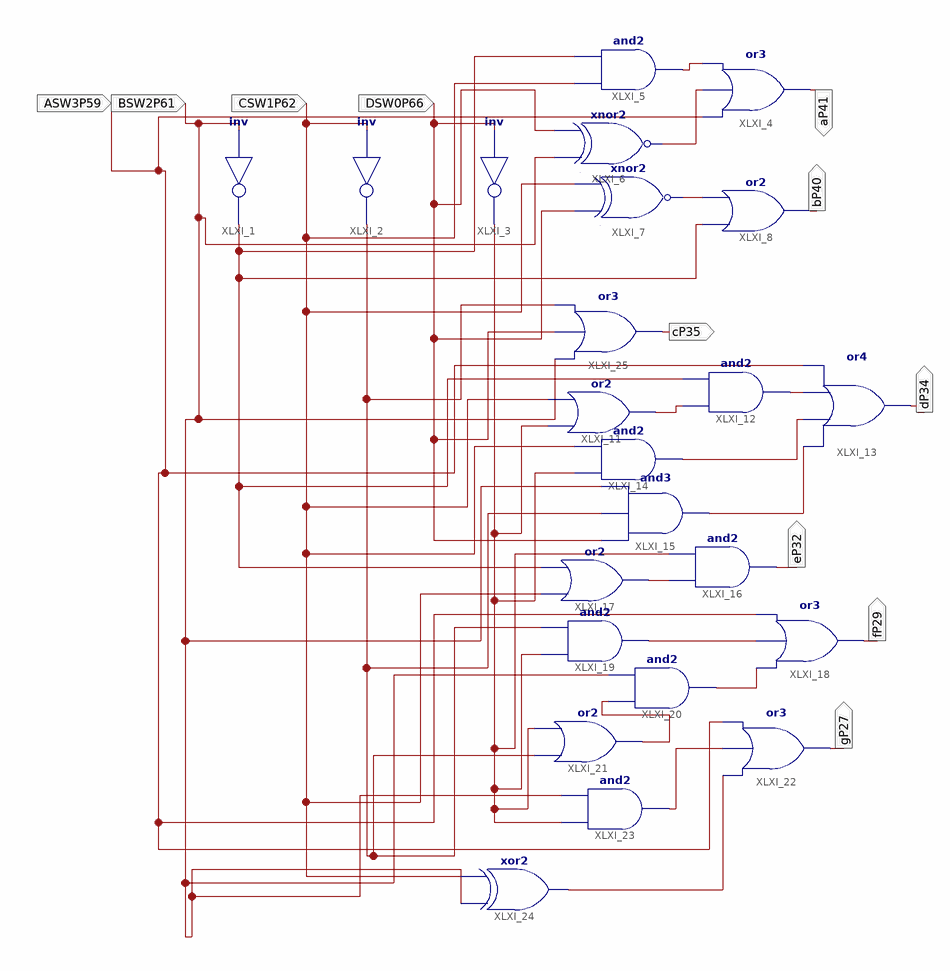
[diagram p0: schematic sheet 1]
// Xilinx ISE schematic lab5sch.sch (spartan6) as structural Verilog: 23 symbols, 11 ports
module lab5sch (
  input  ASW3P59,
  input  CSW1P62,
  input  DSW0P66,
  input  BSW2P61,
  output aP41,
  output bP40,
  output cP35,
  output dP34,
  output eP32,
  output fP29,
  output gP27
);

  wire XLXN_14, XLXN_17, XLXN_22, XLXN_23, XLXN_25, XLXN_27, XLXN_32, XLXN_34, XLXN_35, XLXN_37, XLXN_42,
       XLXN_45, XLXN_46, XLXN_49, XLXN_52, XLXN_55;

  not XLXI_1 (XLXN_14, BSW2P61);
  not XLXI_2 (XLXN_27, CSW1P62);
  not XLXI_3 (XLXN_17, DSW0P66);
  and XLXI_5 (XLXN_22, CSW1P62, XLXN_14);
  or XLXI_4 (aP41, ASW3P59, XLXN_23, XLXN_22);
  xnor XLXI_7 (XLXN_25, DSW0P66, CSW1P62);
  or XLXI_8 (bP40, XLXN_14, XLXN_25);
  or XLXI_25 (cP35, BSW2P61, DSW0P66, XLXN_27);
  or XLXI_13 (dP34, XLXN_37, XLXN_35, XLXN_32, ASW3P59);
  and XLXI_12 (XLXN_32, XLXN_34, XLXN_14);
  or XLXI_11 (XLXN_34, XLXN_17, CSW1P62);
  and XLXI_14 (XLXN_35, XLXN_17, CSW1P62);
  and XLXI_15 (XLXN_37, DSW0P66, XLXN_27, BSW2P61);
  or XLXI_17 (XLXN_42, CSW1P62, XLXN_14);
  and XLXI_16 (eP32, XLXN_42, XLXN_17);
  and XLXI_19 (XLXN_45, XLXN_17, XLXN_27);
  and XLXI_20 (XLXN_46, XLXN_49, BSW2P61);
  or XLXI_21 (XLXN_49, XLXN_27, XLXN_17);
  or XLXI_18 (fP29, XLXN_46, XLXN_45, ASW3P59);
  and XLXI_23 (XLXN_52, XLXN_17, BSW2P61);
  or XLXI_22 (gP27, XLXN_55, XLXN_52, ASW3P59);
  xor XLXI_24 (XLXN_55, BSW2P61, CSW1P62);
  xnor XLXI_6 (XLXN_23, BSW2P61, DSW0P66);
endmodule
